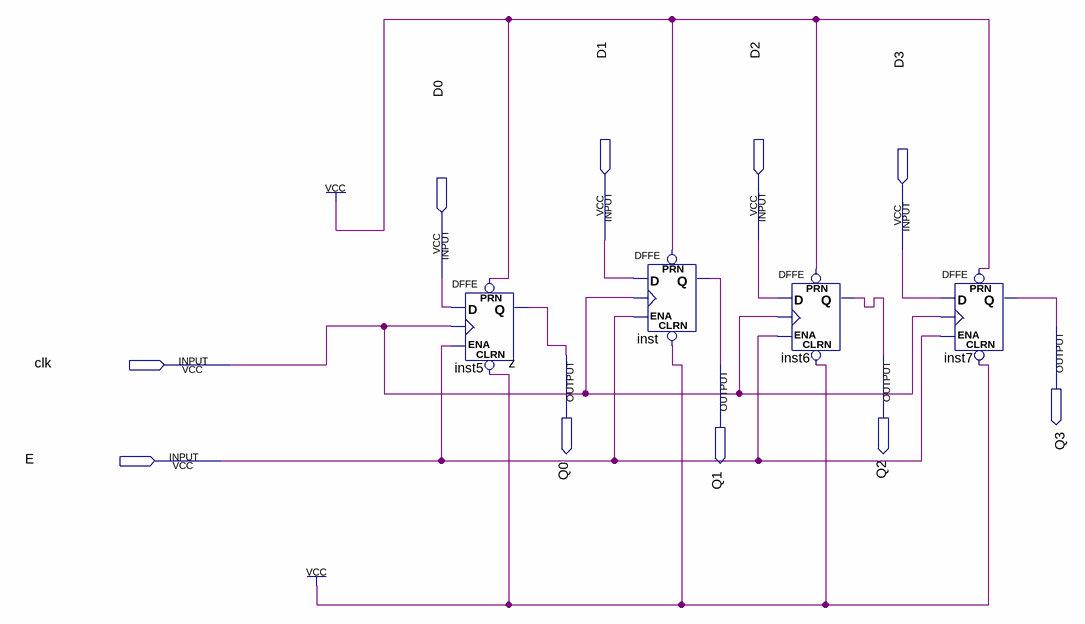
[diagram p0: schematic sheet]
// Quartus schematic reg.bdf as structural Verilog: 4 symbols, 10 pins
module \reg  (
  input  D1,
  input  D2,
  input  D3,
  input  D0,
  input  clk,
  input  E,
  output Q3,
  output Q0,
  output Q2,
  output Q1
);

  DFFE inst5 (.PRN(1'b1), .CLRN(1'b1), .D(D0), .CLK(clk), .ENA(E), .Q(Q0));
  DFFE inst (.PRN(1'b1), .CLRN(1'b1), .D(D1), .CLK(clk), .ENA(E), .Q(Q1));
  DFFE inst6 (.PRN(1'b1), .CLRN(1'b1), .D(D2), .CLK(clk), .ENA(E), .Q(Q2));
  DFFE inst7 (.PRN(1'b1), .CLRN(1'b1), .D(D3), .CLK(clk), .ENA(E), .Q(Q3));
endmodule
